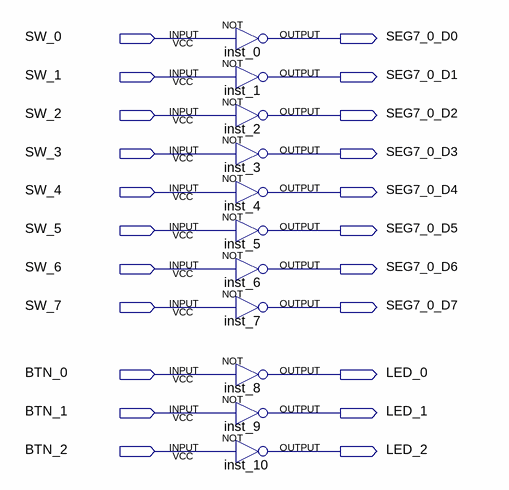
[diagram p0: schematic sheet]
// Quartus schematic Lab1.bdf as structural Verilog: 11 symbols, 22 pins
module Lab1 (
  input  SW_0,
  input  SW_1,
  input  SW_2,
  input  SW_3,
  input  SW_4,
  input  SW_5,
  input  SW_6,
  input  SW_7,
  input  BTN_0,
  input  BTN_1,
  input  BTN_2,
  output SEG7_0_D0,
  output SEG7_0_D1,
  output SEG7_0_D2,
  output SEG7_0_D3,
  output SEG7_0_D4,
  output SEG7_0_D5,
  output SEG7_0_D6,
  output SEG7_0_D7,
  output LED_0,
  output LED_1,
  output LED_2
);

  not inst_0 (SEG7_0_D0, SW_0);
  not inst_1 (SEG7_0_D1, SW_1);
  not inst_2 (SEG7_0_D2, SW_2);
  not inst_3 (SEG7_0_D3, SW_3);
  not inst_4 (SEG7_0_D4, SW_4);
  not inst_5 (SEG7_0_D5, SW_5);
  not inst_6 (SEG7_0_D6, SW_6);
  not inst_7 (SEG7_0_D7, SW_7);
  not inst_8 (LED_0, BTN_0);
  not inst_9 (LED_1, BTN_1);
  not inst_10 (LED_2, BTN_2);
endmodule
